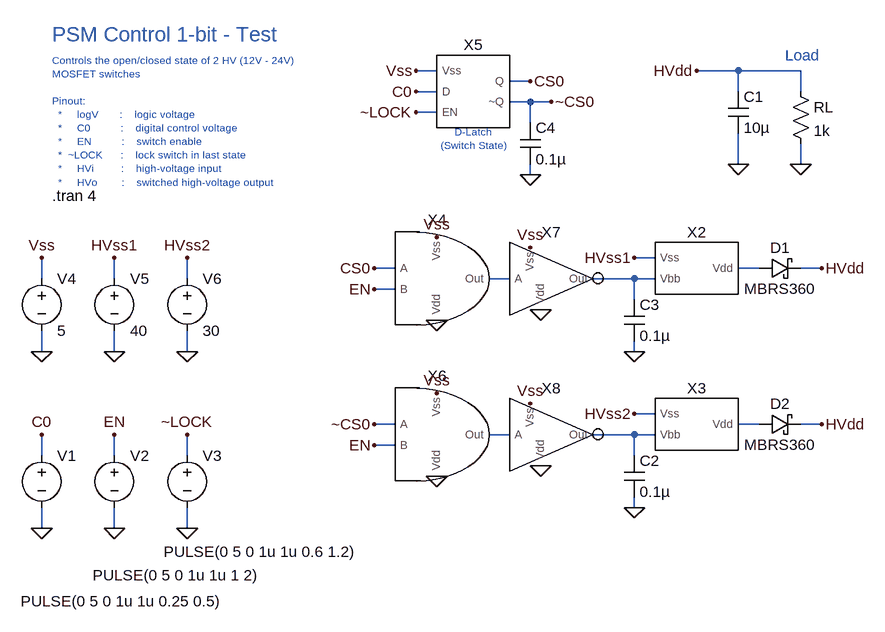
[diagram p0: schematic PSM-control-test-1.asc]
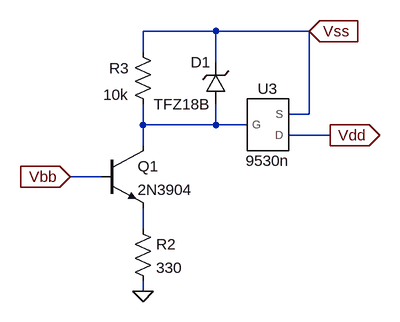
[diagram p1: sub-circuit 9530n_pmos_hss.asc]
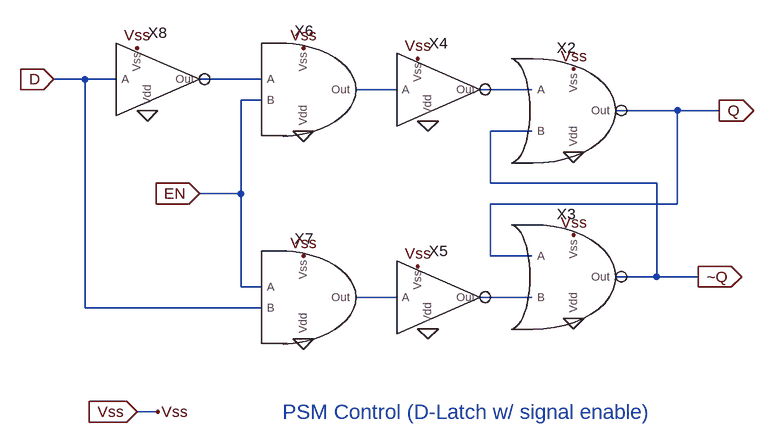
[diagram p2: sub-circuit cmos_dlatch.asc]
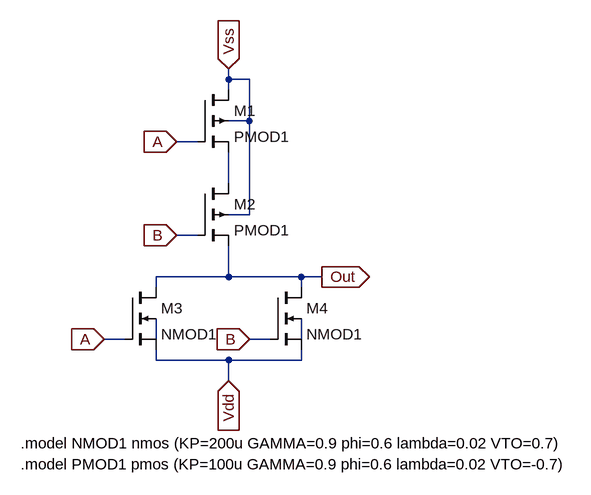
[diagram p3: sub-circuit cmos_nor.asc]
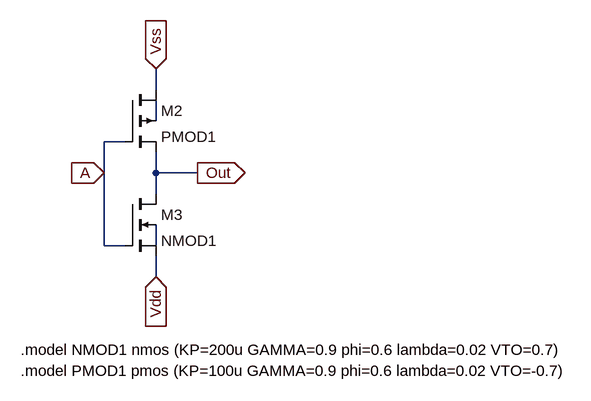
[diagram p4: sub-circuit cmos_inv.asc]
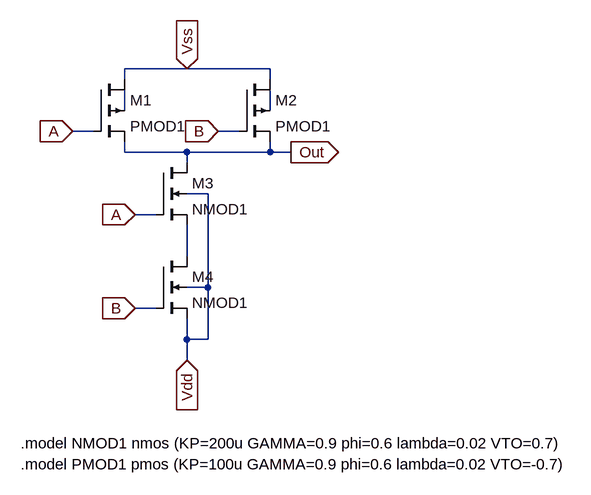
[diagram p5: sub-circuit cmos_nand.asc]
PSM-control-test-1.asc, the LTspice schematic file:
Version 4
SHEET 1 1588 1108
WIRE 144 -208 112 -208
WIRE 608 -208 544 -208
WIRE 704 -208 608 -208
WIRE 288 -192 256 -192
WIRE 144 -176 112 -176
WIRE 608 -176 608 -208
WIRE 704 -176 704 -208
WIRE 288 -160 256 -160
WIRE 320 -160 288 -160
WIRE 144 -144 112 -144
WIRE 288 -128 288 -160
WIRE 608 -64 608 -112
WIRE 704 -64 704 -96
WIRE 288 -48 288 -64
WIRE 480 80 448 80
WIRE 80 96 48 96
WIRE 640 96 608 96
WIRE 736 96 704 96
WIRE -464 112 -464 80
WIRE -352 112 -352 80
WIRE -240 112 -240 80
WIRE 256 112 224 112
WIRE 448 112 384 112
WIRE 480 112 448 112
WIRE 80 128 48 128
WIRE 448 144 448 112
WIRE -464 224 -464 192
WIRE -352 224 -352 192
WIRE -240 224 -240 192
WIRE 448 224 448 208
WIRE 480 320 448 320
WIRE 80 336 48 336
WIRE 640 336 608 336
WIRE 736 336 704 336
WIRE 256 352 224 352
WIRE 448 352 384 352
WIRE 480 352 448 352
WIRE 80 368 48 368
WIRE -464 384 -464 352
WIRE -352 384 -352 352
WIRE -240 384 -240 352
WIRE 448 384 448 352
WIRE 448 464 448 448
WIRE -464 496 -464 464
WIRE -352 496 -352 464
WIRE -240 496 -240 464
FLAG -240 496 0
FLAG -352 496 0
FLAG -464 496 0
FLAG -464 224 0
FLAG -464 80 Vss
FLAG -464 352 C0
FLAG -352 352 EN
FLAG -240 352 ~LOCK
FLAG 112 -208 Vss
FLAG 112 -144 ~LOCK
FLAG 48 128 EN
FLAG 288 -192 CS0
FLAG -352 224 0
FLAG -352 80 HVss1
FLAG 448 80 HVss1
FLAG 736 96 HVdd
FLAG 112 -176 C0
FLAG 544 -208 HVdd
FLAG 704 -64 0
FLAG 608 -64 0
FLAG 448 464 0
FLAG 448 320 HVss2
FLAG 736 336 HVdd
FLAG -240 224 0
FLAG -240 80 HVss2
FLAG 320 -160 ~CS0
FLAG 448 224 0
FLAG 48 96 CS0
FLAG 144 48 Vss
FLAG 144 176 0
FLAG 48 368 EN
FLAG 48 336 ~CS0
FLAG 144 288 Vss
FLAG 144 416 0
FLAG 304 160 0
FLAG 304 400 0
FLAG 288 64 Vss
FLAG 288 304 Vss
FLAG 288 -48 0
SYMBOL voltage -464 368 R0
WINDOW 3 -32 240 Left 2
WINDOW 123 0 0 Left 0
WINDOW 39 0 0 Left 0
SYMATTR Value PULSE(0 5 0 1u 1u 0.25 0.5)
SYMATTR InstName V1
SYMBOL voltage -352 368 R0
WINDOW 3 -33 200 Left 2
WINDOW 123 0 0 Left 0
WINDOW 39 0 0 Left 0
SYMATTR Value PULSE(0 5 0 1u 1u 1 2)
SYMATTR InstName V2
SYMBOL voltage -240 368 R0
WINDOW 3 -36 164 Left 2
WINDOW 123 0 0 Left 0
WINDOW 39 0 0 Left 0
SYMATTR Value PULSE(0 5 0 1u 1u 0.6 1.2)
SYMATTR InstName V3
SYMBOL voltage -464 96 R0
WINDOW 123 0 0 Left 0
WINDOW 39 0 0 Left 0
SYMATTR InstName V4
SYMATTR Value 5
SYMBOL voltage -352 96 R0
WINDOW 123 0 0 Left 0
WINDOW 39 0 0 Left 0
SYMATTR InstName V5
SYMATTR Value 40
SYMBOL Custom\\PCM\\9530n_PMOS_HSS 544 96 R0
SYMATTR InstName X2
SYMBOL res 688 -192 R0
SYMATTR InstName RL
SYMATTR Value 1k
SYMBOL cap 592 -176 R0
SYMATTR InstName C1
SYMATTR Value 10µ
SYMBOL cap 432 384 R0
SYMATTR InstName C2
SYMATTR Value 0.1µ
SYMBOL Custom\\PCM\\9530n_PMOS_HSS 544 336 R0
SYMATTR InstName X3
SYMBOL voltage -240 96 R0
WINDOW 123 0 0 Left 0
WINDOW 39 0 0 Left 0
SYMATTR InstName V6
SYMATTR Value 30
SYMBOL cap 432 144 R0
SYMATTR InstName C3
SYMATTR Value 0.1µ
SYMBOL schottky 640 352 R270
WINDOW 0 32 32 VTop 2
WINDOW 3 0 32 VBottom 2
SYMATTR InstName D2
SYMATTR Value MBRS360
SYMATTR Description Diode
SYMATTR Type diode
SYMBOL schottky 640 112 R270
WINDOW 0 32 32 VTop 2
WINDOW 3 0 32 VBottom 2
SYMATTR InstName D1
SYMATTR Value MBRS360
SYMATTR Description Diode
SYMATTR Type diode
SYMBOL Custom\\Logic\\CMOS_DLATCH 192 -176 R0
SYMATTR InstName X5
SYMBOL Custom\\Logic\\CMOS_NAND 144 112 R0
SYMATTR InstName X4
SYMBOL Custom\\Logic\\CMOS_NAND 144 352 R0
SYMATTR InstName X6
SYMBOL Custom\\Logic\\CMOS_INV 320 112 R0
SYMATTR InstName X7
SYMBOL Custom\\Logic\\CMOS_INV 320 352 R0
SYMATTR InstName X8
SYMBOL cap 272 -128 R0
SYMATTR InstName C4
SYMATTR Value 0.1µ
TEXT -448 -16 Left 2 !.tran 4
TEXT -448 -264 Left 3 ;PSM Control 1-bit - Test
TEXT -448 -224 Left 1 ;Controls the open/closed state of 2 HV (12V - 24V) \nMOSFET switches\n \nPinout:\n  *     logV       :    logic voltage\n  *     C0          :    digital control voltage\n  *     EN          :    switch enable\n  *  ~LOCK      :    lock switch in last state\n  *     HVi         :    high-voltage input\n  *     HVo        :    switched high-voltage output
TEXT 200 -104 Center 1 ;D-Latch\n(Switch State)
TEXT 680 -232 Left 2 ;Load

9530n_pmos_hss.asc, the sub-circuit schematic file:
Version 4
SHEET 1 1160 680
WIRE 48 0 -64 0
WIRE 192 0 48 0
WIRE -64 32 -64 0
WIRE 48 48 48 0
WIRE 192 128 192 0
WIRE 192 128 160 128
WIRE -64 144 -64 112
WIRE 48 144 48 112
WIRE 48 144 -64 144
WIRE 96 144 48 144
WIRE 224 160 160 160
WIRE -64 176 -64 144
WIRE -128 224 -176 224
WIRE -64 304 -64 272
WIRE -64 400 -64 384
FLAG 192 0 Vss
IOPIN 192 0 In
FLAG -176 224 Vbb
IOPIN -176 224 In
FLAG 224 160 Vdd
IOPIN 224 160 Out
FLAG -64 400 0
SYMBOL 9530n 128 144 R0
SYMATTR InstName U3
SYMBOL npn -128 176 R0
SYMATTR InstName Q1
SYMATTR Value 2N3904
SYMBOL res -80 16 R0
WINDOW 0 -36 41 Left 2
WINDOW 3 -45 82 Left 2
SYMATTR InstName R3
SYMATTR Value 10k
SYMBOL zener 64 112 R180
WINDOW 0 24 64 Left 2
WINDOW 3 24 0 Left 2
SYMATTR InstName D1
SYMATTR Value TFZ18B
SYMBOL res -80 288 R0
SYMATTR InstName R2
SYMATTR Value 330

cmos_dlatch.asc, the sub-circuit schematic file:
Version 4
SHEET 1 1588 680
WIRE -432 -480 -480 -480
WIRE -384 -480 -432 -480
WIRE -160 -480 -256 -480
WIRE 48 -464 -16 -464
WIRE 256 -464 176 -464
WIRE -160 -448 -192 -448
WIRE 480 -432 384 -432
WIRE 544 -432 480 -432
WIRE 256 -400 192 -400
WIRE 192 -320 192 -400
WIRE 448 -320 192 -320
WIRE -192 -304 -192 -448
WIRE -192 -304 -256 -304
WIRE 480 -288 480 -432
WIRE 480 -288 192 -288
WIRE 192 -208 192 -288
WIRE 256 -208 192 -208
WIRE 448 -176 448 -320
WIRE 448 -176 384 -176
WIRE 512 -176 448 -176
WIRE -192 -160 -192 -304
WIRE -160 -160 -192 -160
WIRE 48 -144 -16 -144
WIRE 256 -144 176 -144
WIRE -432 -128 -432 -480
WIRE -160 -128 -432 -128
WIRE -320 32 -352 32
FLAG -320 32 Vss
FLAG 544 -432 Q
IOPIN 544 -432 Out
FLAG 320 -496 Vss
FLAG 320 -240 Vss
FLAG 80 -192 Vss
FLAG 80 -512 Vss
FLAG 320 -368 0
FLAG 320 -112 0
FLAG 96 -96 0
FLAG 96 -416 0
FLAG -96 -400 0
FLAG -96 -528 Vss
FLAG -96 -80 0
FLAG -96 -208 Vss
FLAG -352 -528 Vss
FLAG -336 -432 0
FLAG -256 -304 EN
IOPIN -256 -304 In
FLAG -480 -480 D
IOPIN -480 -480 In
FLAG -352 32 Vss
IOPIN -352 32 In
FLAG 512 -176 ~Q
IOPIN 512 -176 Out
SYMBOL Custom\\Logic\\CMOS_NOR 304 -432 R0
SYMATTR InstName X2
SYMBOL Custom\\Logic\\CMOS_NOR 304 -176 R0
SYMATTR InstName X3
SYMBOL Custom\\Logic\\CMOS_INV 112 -464 R0
SYMATTR InstName X4
SYMBOL Custom\\Logic\\CMOS_INV 112 -144 R0
SYMATTR InstName X5
SYMBOL Custom\\Logic\\CMOS_NAND -96 -464 R0
SYMATTR InstName X6
SYMBOL Custom\\Logic\\CMOS_NAND -96 -144 R0
SYMATTR InstName X7
SYMBOL Custom\\Logic\\CMOS_INV -320 -480 R0
SYMATTR InstName X8
TEXT -128 32 Left 3 ;PSM Control (D-Latch w/ signal enable)

cmos_nor.asc, the sub-circuit schematic file:
Version 4
SHEET 1 880 680
WIRE 208 48 208 32
WIRE 240 48 208 48
WIRE 208 64 208 48
WIRE 240 112 240 48
WIRE 240 112 208 112
WIRE 160 144 128 144
WIRE 208 208 208 160
WIRE 240 256 240 112
WIRE 240 256 208 256
WIRE 160 288 128 288
WIRE 208 352 208 304
WIRE 208 352 96 352
WIRE 320 352 208 352
WIRE 352 352 320 352
WIRE 96 368 96 352
WIRE 320 368 320 352
WIRE 48 448 16 448
WIRE 96 448 96 416
WIRE 272 448 240 448
WIRE 320 448 320 416
WIRE 96 480 96 464
WIRE 208 480 96 480
WIRE 320 480 320 464
WIRE 320 480 208 480
WIRE 208 512 208 480
FLAG 208 32 Vss
IOPIN 208 32 In
FLAG 208 512 Vdd
IOPIN 208 512 In
FLAG 16 448 A
IOPIN 16 448 In
FLAG 128 144 A
IOPIN 128 144 In
FLAG 240 448 B
IOPIN 240 448 In
FLAG 128 288 B
IOPIN 128 288 In
FLAG 352 352 Out
IOPIN 352 352 Out
SYMBOL nmos4 48 368 R0
SYMATTR InstName M3
SYMATTR Value NMOD1
SYMATTR Value2 l=1u w=25u
SYMBOL nmos4 272 368 R0
SYMATTR InstName M4
SYMATTR Value NMOD1
SYMATTR Value2 l=1u w=25u
SYMBOL pmos4 160 64 R0
SYMATTR InstName M1
SYMATTR Value PMOD1
SYMATTR Value2 l=1u w=100u
SYMBOL pmos4 160 208 R0
SYMATTR InstName M2
SYMATTR Value PMOD1
SYMATTR Value2 l=1u w=100u
TEXT -112 640 Left 2 !.model PMOD1 pmos (KP=100u GAMMA=0.9 phi=0.6 lambda=0.02 VTO=-0.7)
TEXT -112 608 Left 2 !.model NMOD1 nmos (KP=200u GAMMA=0.9 phi=0.6 lambda=0.02 VTO=0.7)

cmos_inv.asc, the sub-circuit schematic file:
Version 4
SHEET 1 880 680
WIRE 96 208 96 176
WIRE 96 256 96 224
WIRE 48 288 16 288
WIRE 16 336 16 288
WIRE 96 336 96 304
WIRE 160 336 96 336
WIRE 96 368 96 336
WIRE 16 448 16 336
WIRE 48 448 16 448
WIRE 96 448 96 416
WIRE 96 496 96 464
FLAG 96 176 Vss
IOPIN 96 176 In
FLAG 96 496 Vdd
IOPIN 96 496 In
FLAG 16 336 A
IOPIN 16 336 In
FLAG 160 336 Out
IOPIN 160 336 Out
SYMBOL nmos4 48 368 R0
SYMATTR InstName M3
SYMATTR Value NMOD1
SYMATTR Value2 l=1u w=25u
SYMBOL pmos4 48 208 R0
SYMATTR InstName M2
SYMATTR Value PMOD1
SYMATTR Value2 l=1u w=100u
TEXT -112 640 Left 2 !.model PMOD1 pmos (KP=100u GAMMA=0.9 phi=0.6 lambda=0.02 VTO=-0.7)
TEXT -112 608 Left 2 !.model NMOD1 nmos (KP=200u GAMMA=0.9 phi=0.6 lambda=0.02 VTO=0.7)

cmos_nand.asc, the sub-circuit schematic file:
Version 4
SHEET 1 880 680
WIRE 144 32 48 32
WIRE 272 32 144 32
WIRE 48 48 48 32
WIRE 272 48 272 32
WIRE 48 96 48 64
WIRE 272 96 272 64
WIRE 0 128 -32 128
WIRE 224 128 192 128
WIRE 48 160 48 144
WIRE 144 160 48 160
WIRE 272 160 272 144
WIRE 272 160 144 160
WIRE 304 160 272 160
WIRE 144 176 144 160
WIRE 176 224 144 224
WIRE 96 256 64 256
WIRE 144 320 144 272
WIRE 176 368 176 224
WIRE 176 368 144 368
WIRE 96 400 64 400
WIRE 144 448 144 416
WIRE 176 448 176 368
WIRE 176 448 144 448
WIRE 144 480 144 448
FLAG 144 32 Vss
IOPIN 144 32 In
FLAG 144 480 Vdd
IOPIN 144 480 In
FLAG -32 128 A
IOPIN -32 128 In
FLAG 64 256 A
IOPIN 64 256 In
FLAG 192 128 B
IOPIN 192 128 In
FLAG 64 400 B
IOPIN 64 400 In
FLAG 304 160 Out
IOPIN 304 160 Out
SYMBOL nmos4 96 176 R0
SYMATTR InstName M3
SYMATTR Value NMOD1
SYMATTR Value2 l=1u w=50u
SYMBOL nmos4 96 320 R0
SYMATTR InstName M4
SYMATTR Value NMOD1
SYMATTR Value2 l=1u w=50u
SYMBOL pmos4 0 48 R0
SYMATTR InstName M1
SYMATTR Value PMOD1
SYMATTR Value2 l=1u w=50u
SYMBOL pmos4 224 48 R0
SYMATTR InstName M2
SYMATTR Value PMOD1
SYMATTR Value2 l=1u w=50u
TEXT -112 640 Left 2 !.model PMOD1 pmos (KP=100u GAMMA=0.9 phi=0.6 lambda=0.02 VTO=-0.7)
TEXT -112 608 Left 2 !.model NMOD1 nmos (KP=200u GAMMA=0.9 phi=0.6 lambda=0.02 VTO=0.7)

The netlist it stands for:
* PSM-control-test-1.asc
V1 C0 0 PULSE(0 5 0 1u 1u 0.25 0.5)
V2 EN 0 PULSE(0 5 0 1u 1u 1 2)
V3 ~LOCK 0 PULSE(0 5 0 1u 1u 0.6 1.2)
V4 Vss 0 5
V5 HVss1 0 40
XX2 HVss1 N003 N001 9530n_pmos_hss
RL HVdd 0 1k
C1 HVdd 0 10µ
C2 N006 0 0.1µ
XX3 HVss2 N006 N004 9530n_pmos_hss
V6 HVss2 0 30
C3 N003 0 0.1µ
D2 N004 HVdd MBRS360
D1 N001 HVdd MBRS360
XX5 C0 ~LOCK Vss CS0 ~CS0 cmos_dlatch
XX4 CS0 EN 0 Vss N002 cmos_nand
XX6 ~CS0 EN 0 Vss N005 cmos_nand
XX7 N002 0 Vss N003 cmos_inv
XX8 N005 0 Vss N006 cmos_inv
C4 ~CS0 0 0.1µ

* block symbol definitions
.subckt 9530n_pmos_hss Vss Vbb Vdd
XU3 Vdd N001 Vss 9530n  ; pins D G S
Q1 N001 Vbb N002 0 2N3904
R3 Vss N001 10k
D1 N001 Vss TFZ18B
R2 N002 0 330
.ends 9530n_pmos_hss

.subckt cmos_dlatch D EN Vss Q ~Q
XX2 N003 ~Q 0 Vss Q cmos_nor
XX3 Q N005 0 Vss ~Q cmos_nor
XX4 N002 0 Vss N003 cmos_inv
XX5 N004 0 Vss N005 cmos_inv
XX6 N001 EN 0 Vss N002 cmos_nand
XX7 EN D 0 Vss N004 cmos_nand
XX8 D 0 Vss N001 cmos_inv
* PSM Control (D-Latch w/ signal enable)
.ends cmos_dlatch

.subckt cmos_nor A B Vdd Vss Out
M3 Out A Vdd N002 NMOD1 l=1u w=25u
M4 Out B Vdd N003 NMOD1 l=1u w=25u
M1 Vss A N001 Vss PMOD1 l=1u w=100u
M2 N001 B Out Vss PMOD1 l=1u w=100u
.model PMOD1 pmos (KP=100u GAMMA=0.9 phi=0.6 lambda=0.02 VTO=-0.7)
.model NMOD1 nmos (KP=200u GAMMA=0.9 phi=0.6 lambda=0.02 VTO=0.7)
.ends cmos_nor

.subckt cmos_inv A Vdd Vss Out
M3 Out A Vdd N002 NMOD1 l=1u w=25u
M2 Vss A Out N001 PMOD1 l=1u w=100u
.model PMOD1 pmos (KP=100u GAMMA=0.9 phi=0.6 lambda=0.02 VTO=-0.7)
.model NMOD1 nmos (KP=200u GAMMA=0.9 phi=0.6 lambda=0.02 VTO=0.7)
.ends cmos_inv

.subckt cmos_nand A B Vdd Vss Out
M3 Out A N003 Vdd NMOD1 l=1u w=50u
M4 N003 B Vdd Vdd NMOD1 l=1u w=50u
M1 Vss A Out N001 PMOD1 l=1u w=50u
M2 Vss B Out N002 PMOD1 l=1u w=50u
.model PMOD1 pmos (KP=100u GAMMA=0.9 phi=0.6 lambda=0.02 VTO=-0.7)
.model NMOD1 nmos (KP=200u GAMMA=0.9 phi=0.6 lambda=0.02 VTO=0.7)
.ends cmos_nand

.model D D
.lib standard.dio
.model NPN NPN
.model PNP PNP
.lib standard.bjt
.model NMOS NMOS
.model PMOS PMOS
.lib standard.mos
.tran 4
* PSM Control 1-bit - Test
* Controls the open/closed state of 2 HV (12V - 24V)
* MOSFET switches
* Pinout:
*   *     logV       :    logic voltage
*   *     C0          :    digital control voltage
*   *     EN          :    switch enable
*   *  ~LOCK      :    lock switch in last state
*   *     HVi         :    high-voltage input
*   *     HVo        :    switched high-voltage output
* D-Latch
* (Switch State)
* Load
.lib 9530n.spi
.backanno
.end